# Altium schematic sheet usb_host_otg.SchDoc
size A3; SheetNumber: 17; SheetTotal: 21
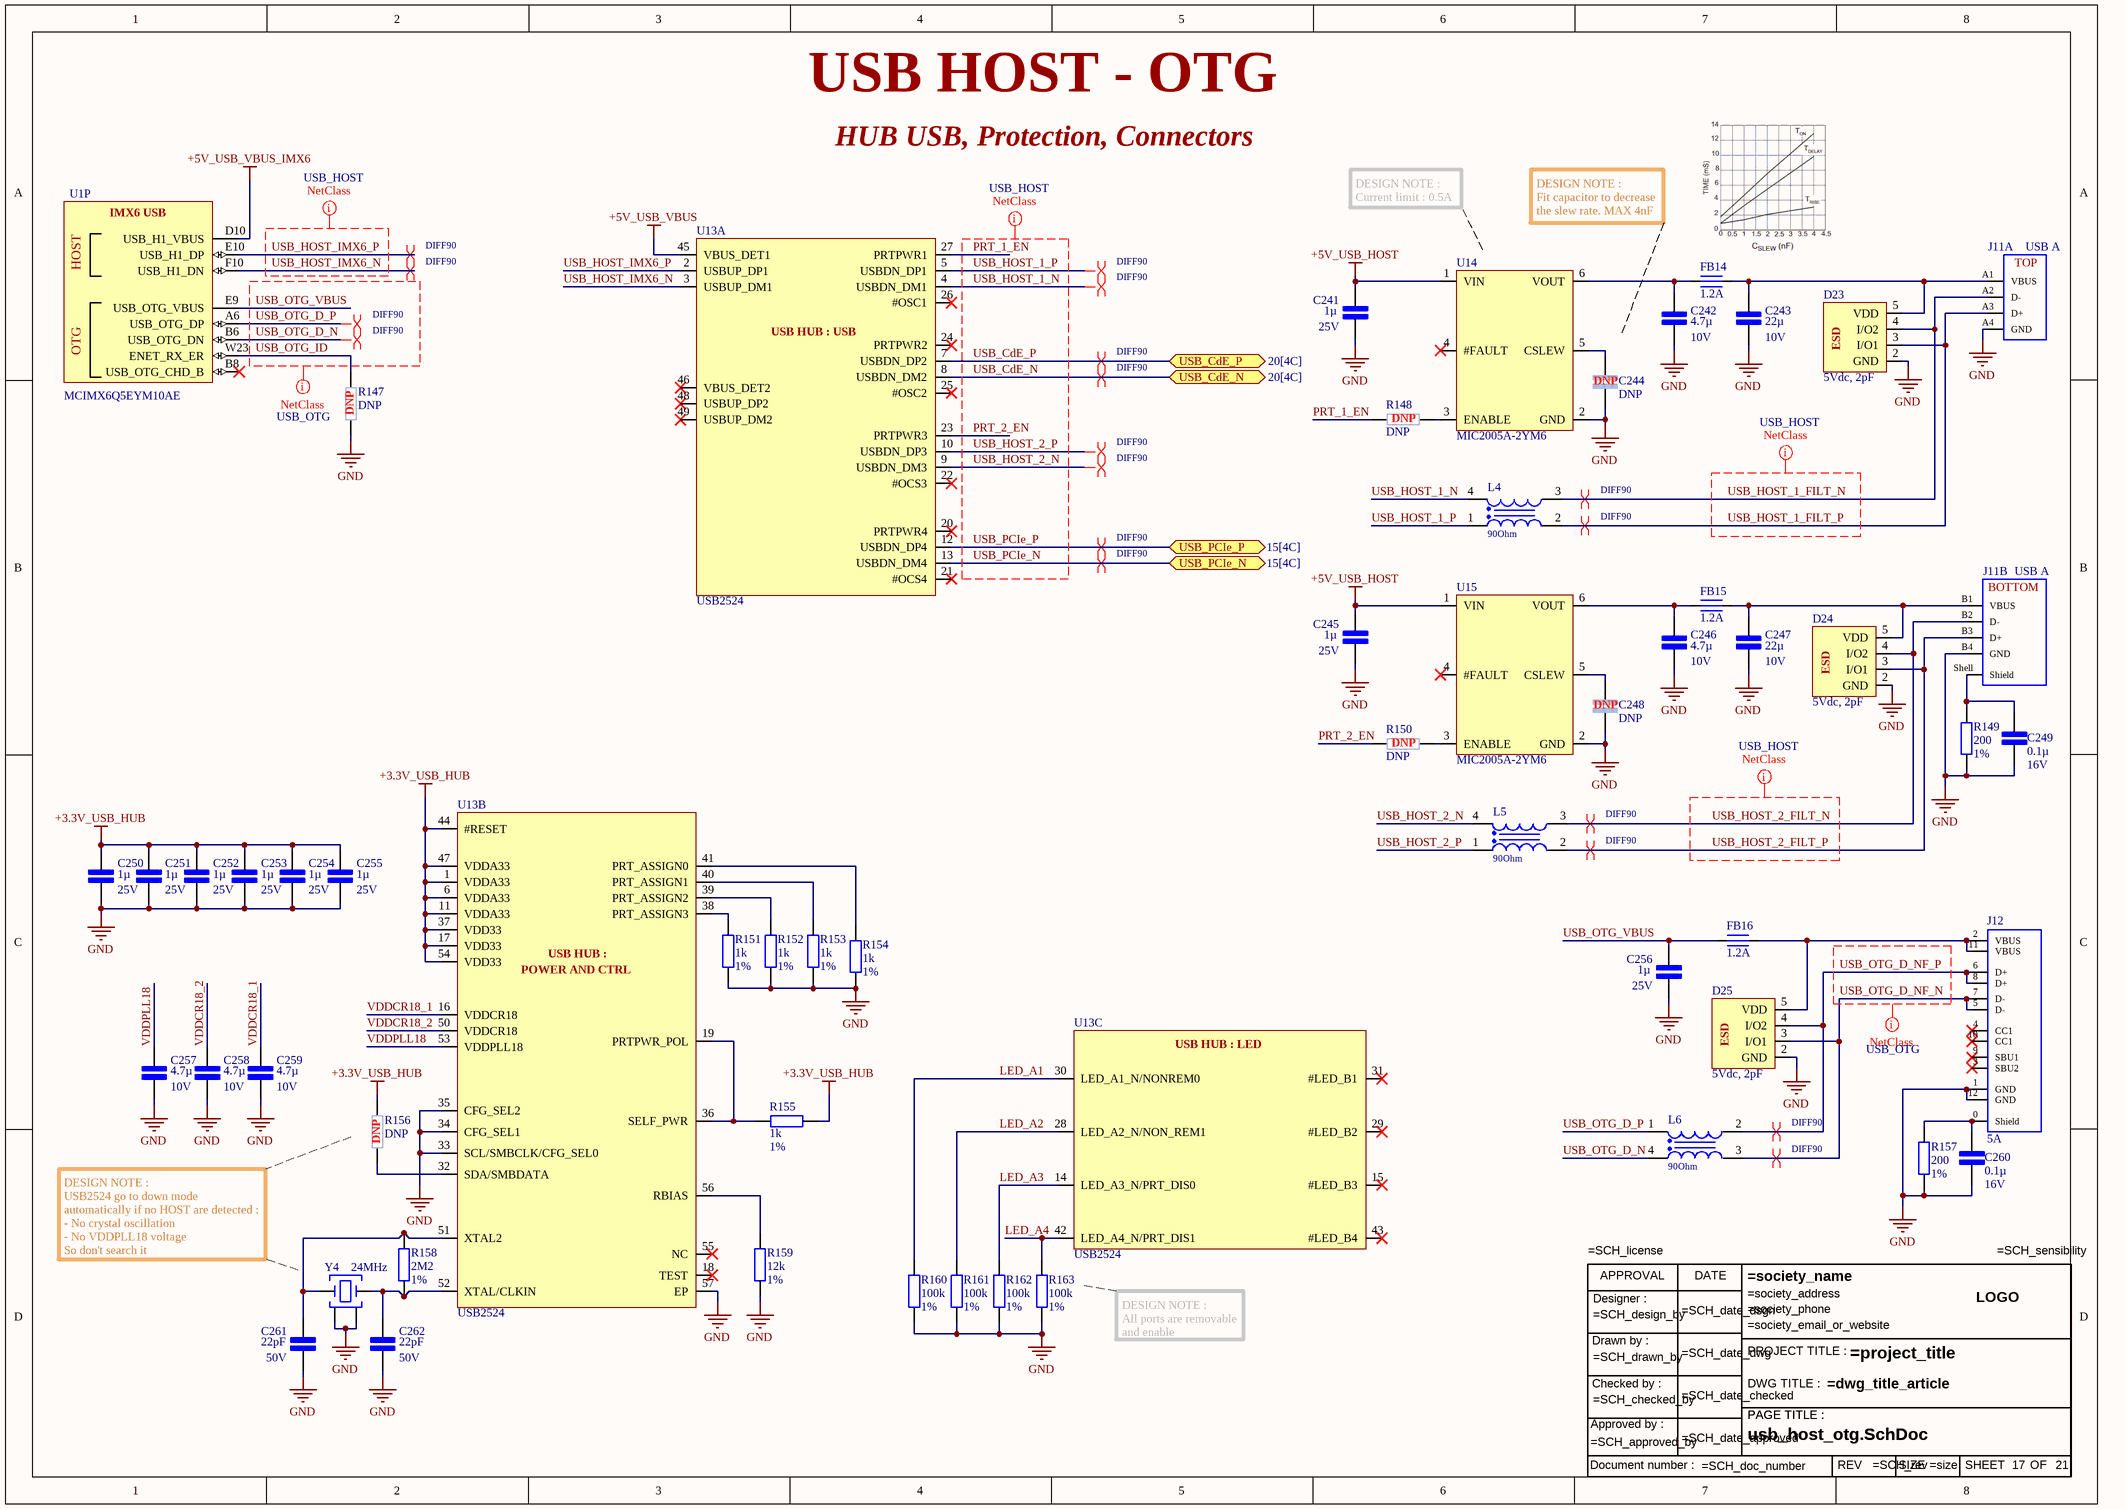
[diagram p0: usb_host_otg.SchDoc]

## Parts
C241  1µ  Tension du diélectrique: 25V  [Cap cer 0402/1005]
C242  4.7µ  Tension du diélectrique: 10V  [Cap cer 0402/1005]
C243  22µ  Tension du diélectrique: 10V  [Cap cer 0603/4608]
C244  DNP  [Cap cer 0402/1005]
C245  1µ  Tension du diélectrique: 25V  [Cap cer 0402/1005]
C246  4.7µ  Tension du diélectrique: 10V  [Cap cer 0402/1005]
C247  22µ  Tension du diélectrique: 10V  [Cap cer 0603/4608]
C248  DNP  [Cap cer 0402/1005]
C249  0.1µ  Tension du diélectrique: 16V  [Cap cer 0402/1005]
C250  1µ  Tension du diélectrique: 25V  [Cap cer 0402/1005]
C251  1µ  Tension du diélectrique: 25V  [Cap cer 0402/1005]
C252  1µ  Tension du diélectrique: 25V  [Cap cer 0402/1005]
C253  1µ  Tension du diélectrique: 25V  [Cap cer 0402/1005]
C254  1µ  Tension du diélectrique: 25V  [Cap cer 0402/1005]
C255  1µ  Tension du diélectrique: 25V  [Cap cer 0402/1005]
C256  1µ  Tension du diélectrique: 25V  [Cap cer 0402/1005]
C257  4.7µ  Tension du diélectrique: 10V  [Cap cer 0402/1005]
C258  4.7µ  Tension du diélectrique: 10V  [Cap cer 0402/1005]
C259  4.7µ  Tension du diélectrique: 10V  [Cap cer 0402/1005]
C260  0.1µ  Tension du diélectrique: 16V  [Cap cer 0402/1005]
C261  22pF  Tension du diélectrique: 50V  [Cap cer 0402/1005]
C262  22pF  Tension du diélectrique: 50V  [Cap cer 0402/1005]
D23  5Vdc, 2pF  [Sot-23-5]
D24  5Vdc, 2pF  [Sot-23-5]
D25  5Vdc, 2pF  [Sot-23-5]
FB14  1.2A  [inductor 0402/1005]
FB15  1.2A  [inductor 0402/1005]
FB16  1.2A  [inductor 0402/1005]
J11  USB A  [USBA_stacked_61400826021]  (parts A,B of 2)
J12  5A  [USB C 12 PIN 629722000214]
L4  90Ohm  [inductor coupled usb 0603]
L5  90Ohm  [inductor coupled usb 0603]
L6  90Ohm  [inductor coupled usb 0603]
R147  DNP  [Res 0402/1005]
R148  DNP  [Res 0402/1005]
R149  200  pourcentage: 1%  [Res 0402/1005]
R150  DNP  [Res 0402/1005]
R151  1k  pourcentage: 1%  [Res 0402/1005]
R152  1k  pourcentage: 1%  [Res 0402/1005]
R153  1k  pourcentage: 1%  [Res 0402/1005]
R154  1k  pourcentage: 1%  [Res 0402/1005]
R155  1k  pourcentage: 1%  [Res 0402/1005]
R156  DNP  [Res 0402/1005]
R157  200  pourcentage: 1%  [Res 0402/1005]
R158  2M2  pourcentage: 1%  [Res 0402/1005]
R159  12k  pourcentage: 1%  [Res 0402/1005]
R160  100k  pourcentage: 1%  [Res 0402/1005]
R161  100k  pourcentage: 1%  [Res 0402/1005]
R162  100k  pourcentage: 1%  [Res 0402/1005]
R163  100k  pourcentage: 1%  [Res 0402/1005]
TB16  Title bloc ANSI modified  (value not drawn)
U1  MCIMX6Q5EYM10AE  [FRES-2197-01]  (part P of 21)
U13  USB2524  [QFN56]  (parts A,B,C of 3)
U14  MIC2005A-2YM6  [SOt-23-6]
U15  MIC2005A-2YM6  [SOt-23-6]
Y4  24MHz  [IQXC-42]

## Ports
USB_CdE_N (bidir, see 20[4C]), USB_CdE_P (bidir, see 20[4C]), USB_PCIe_N (bidir, see 15[4C]), USB_PCIe_P (bidir, see 15[4C])

## Nets
+3.3V_USB_HUB: C250.1 C251.1 C252.1 C253.1 C254.1 C255.1 R155.2 R156.2 U13.1(VDDA33) U13.6(VDDA33) U13.11(VDDA33) U13.17(VDD33) U13.37(VDD33) U13.44(#RESET) U13.47(VDDA33) U13.54(VDD33)
+5V_USB_HOST: C241.1 C245.1 U14.1(VIN) U15.1(VIN)
+5V_USB_VBUS: U13.45(VBUS_DET1)
+5V_USB_VBUS_IMX6: U1.D10(USB_H1_VBUS)
GND: C241.2 C242.2 C243.2 C244.2 C245.2 C246.2 C247.2 C248.2 C249.2 C250.2 C251.2 C252.2 C253.2 C254.2 C255.2 C256.2 C257.2 C258.2 C259.2 C260.2 C261.2 C262.2 D23.2(GND) D24.2(GND) D25.2(GND) J11.A4(GND) J11.B4(GND) J12.1(GND) J12.12(GND) R147.1 R149.1 R151.1 R152.1 R153.1 R154.1 R157.1 R159.1 R160.1 R161.1 R162.1 R163.1 U13.33(SCL/SMBCLK/CFG_SEL0) U13.34(CFG_SEL1) U13.35(CFG_SEL2) U13.57(EP) U14.2(GND) U15.2(GND) Y4.2(GND) Y4.4(GND)
LED_A1: R160.2 U13.30(LED_A1_N/NONREM0)
LED_A2: R161.2 U13.28(LED_A2_N/NON_REM1)
LED_A3: R162.2 U13.14(LED_A3_N/PRT_DIS0)
LED_A4: R163.2 U13.42(LED_A4_N/PRT_DIS1)
PRT_1_EN: R148.1 U13.27(PRTPWR1)
PRT_2_EN: R150.1 U13.23(PRTPWR3)
USB_CdE_N: U13.8(USBDN_DM2) ; port USB_CdE_N
USB_CdE_P: U13.7(USBDN_DP2) ; port USB_CdE_P
USB_HOST_1_FILT_N: D23.4(I/O2) J11.A2(D-) L4.3
USB_HOST_1_FILT_P: D23.3(I/O1) J11.A3(D+) L4.2
USB_HOST_1_N: L4.4 U13.4(USBDN_DM1)
USB_HOST_1_P: L4.1 U13.5(USBDN_DP1)
USB_HOST_2_FILT_N: D24.4(I/O2) J11.B2(D-) L5.3
USB_HOST_2_FILT_P: D24.3(I/O1) J11.B3(D+) L5.2
USB_HOST_2_N: L5.4 U13.9(USBDN_DM3)
USB_HOST_2_P: L5.1 U13.10(USBDN_DP3)
USB_HOST_IMX6_N: U1.F10(USB_H1_DN) U13.3(USBUP_DM1)
USB_HOST_IMX6_P: U1.E10(USB_H1_DP) U13.2(USBUP_DP1)
USB_OTG_D_N: L6.4 U1.B6(USB_OTG_DN)
USB_OTG_D_NF_N: D25.3(I/O1) J12.5(D-) J12.7(D-) L6.3
USB_OTG_D_NF_P: D25.4(I/O2) J12.6(D+) J12.8(D+) L6.2
USB_OTG_D_P: L6.1 U1.A6(USB_OTG_DP)
USB_OTG_ID: R147.2 U1.W23(ENET_RX_ER)
USB_OTG_VBUS: C256.1 FB16.1 U1.E9(USB_OTG_VBUS)
USB_PCIe_N: U13.13(USBDN_DM4) ; port USB_PCIe_N
USB_PCIe_P: U13.12(USBDN_DP4) ; port USB_PCIe_P
VDDCR18_1: C259.1 U13.16(VDDCR18)
VDDCR18_2: C258.1 U13.50(VDDCR18)
VDDPLL18: C257.1 U13.53(VDDPLL18)
NetC242_1: C242.1 FB14.1 U14.6(VOUT)
NetC243_1: C243.1 D23.5(VDD) FB14.2 J11.A1(VBUS)
NetC244_1: C244.1 U14.5(CSLEW)
NetC246_1: C246.1 FB15.1 U15.6(VOUT)
NetC247_1: C247.1 D24.5(VDD) FB15.2 J11.B1(VBUS)
NetC248_1: C248.1 U15.5(CSLEW)
NetC249_1: C249.1 J11.Shell(Shield) R149.2
NetC260_1: C260.1 J12.0(Shield) R157.2
NetC261_1: C261.1 R158.2 U13.51(XTAL2) Y4.3(Crystal)
NetC262_1: C262.1 R158.1 U13.52(XTAL/CLKIN) Y4.1(Crystal)
NetD25_5: D25.5(VDD) FB16.2 J12.2(VBUS) J12.11(VBUS)
NetR148_2: R148.2 U14.3(ENABLE)
NetR150_2: R150.2 U15.3(ENABLE)
NetR151_2: R151.2 U13.38(PRT_ASSIGN3)
NetR152_2: R152.2 U13.39(PRT_ASSIGN2)
NetR153_2: R153.2 U13.40(PRT_ASSIGN1)
NetR154_2: R154.2 U13.41(PRT_ASSIGN0)
NetR155_1: R155.1 U13.19(PRTPWR_POL) U13.36(SELF_PWR)
NetR156_1: R156.1 U13.32(SDA/SMBDATA)
NetR159_2: R159.2 U13.56(RBIAS)

Not connected (* = marked no-connect by the designer): J12 3(SBU2)* 4(CC1)* 9(SBU1)* 10(CC1)*; U1 B8(USB_OTG_CHD_B)*; U13 15(#LED_B3)* 18(TEST)* 20(PRTPWR4)* 21(#OCS4)* 22(#OCS3)* 24(PRTPWR2)* 25(#OSC2)* 26(#OSC1)* 29(#LED_B2)* 31(#LED_B1)* 43(#LED_B4)* 46(VBUS_DET2)* 48(USBUP_DP2)* 49(USBUP_DM2)* 55(NC)*; U14 4(#FAULT)*; U15 4(#FAULT)*

## Layout directives
net class USB_OTG: USB_OTG_D_N, USB_OTG_D_NF_N, USB_OTG_D_NF_P, USB_OTG_D_P, USB_OTG_ID, USB_OTG_VBUS
net class USB_HOST: PRT_1_EN, PRT_2_EN, USB_CdE_N, USB_CdE_P, USB_HOST_1_FILT_N, USB_HOST_1_FILT_P, USB_HOST_1_N, USB_HOST_1_P, USB_HOST_2_FILT_N, USB_HOST_2_FILT_P, USB_HOST_2_N, USB_HOST_2_P, USB_HOST_IMX6_N, USB_HOST_IMX6_P, USB_PCIe_N, USB_PCIe_P
differential pair; differential pair class DIFF90: USB_CdE_N, USB_CdE_P, USB_HOST_1_FILT_N, USB_HOST_1_FILT_P, USB_HOST_1_N, USB_HOST_1_P, USB_HOST_2_FILT_N, USB_HOST_2_FILT_P, USB_HOST_2_N, USB_HOST_2_P, USB_HOST_IMX6_N, USB_HOST_IMX6_P, USB_OTG_D_N, USB_OTG_D_NF_N, USB_OTG_D_NF_P, USB_OTG_D_P, USB_PCIe_N, USB_PCIe_P

## Notes on the sheet
- USB HOST - OTG
- HUB USB, Protection, Connectors
- DESIGN NOTE :
  Current limit : 0.5A
- DESIGN NOTE :
  Fit capacitor to decrease the slew rate. MAX 4nF
- DESIGN NOTE :
  USB2524 go to down mode automatically if no HOST are detected :
  - No crystal oscillation
  - No VDDPLL18 voltage
  So don't search it
- DESIGN NOTE :
  All ports are removable and enable
- (in symbol IC USB2524, part A) USB HUB : USB
- (in symbol IC USB2524, part B) USB HUB :; POWER AND CTRL
- (in symbol IC USB2524, part C) USB HUB : LED
- (in symbol IMX6Q5EYM10AE, part P) IMX6 USB; HOST; OTG
- (in symbol Title bloc ANSI) APPROVAL; DATE; Designer :; LOGO; Drawn by :; PROJECT TITLE :; Checked by :; DWG TITLE :; PAGE TITLE :; Approved by :; Document number :; REV; SIZE; SHEET; OF
- (in symbol TVS USB 824011) ESD
- (in symbol USBA_stacked_61400826021, part A) TOP
- (in symbol USBA_stacked_61400826021, part B) BOTTOM

## Library data of the parts
C241 C245 C250-C256 = cap 1µ 25V: cap cer 1µ 25V 10% X5R 0402; Diélectrique: X5R
C242 C246 C257-C259 = cap 4.7µ 10V: cap cer 4.7µ 10V 10% X7R 0402; Diélectrique: X7R
C243 C247 = cap 22µ 10V: cap cer 22µ 10V 10% X5R 0603; Diélectrique: X5R
C244 C248 = cap DNP: cap cer DNP 0402
C249 C260 = cap 0.1µ 16V: cap solid electrolyte 0.1µ 6.3V 10%; Diélectrique: X7R
C261 C262 = cap 22pF 50V: cap cer 22pF 50V 5% NP0 0402; Diélectrique: NP0
D23-D25 = TVS USB 824011: WE-TVS TVS Diode – High Speed Series, SOT23-5L, 2+1 Channel, 5Vdc, 2pF; Manufacturer Part Number: 824011; Manufacturer: Wurth Elektronik; Reverse Peak Pulse Current: 13A; Channel ESD Clamping Voltage: 13V; Channel Operating Voltage: 5V; Channel Reverse Leakage Current: 1uA; ESD Air Discharge Capability: 24kV; ESD Contact Discharge Capability: 16kV; Polarity: Unidirectional; Reverse Breakdown Voltage: 6.1V; ComponentLink1Description: Manufacturer Link; ComponentLink1URL: http://www.we-online.de; ComponentLink2Description: Datasheet; ComponentLink2URL: https://www.we-online.com/catalog/datasheet/824011.pdf; Size: SOT23-5L; Mounting Technology: SMT; Packaging: Tape and Reel; Channel Input Capacitance: 2pF; Channel Number: 2+1; Height: 1.16mm; Length: 2.9mm; Operating Temperature max.: 125C; Operating Temperature min.: -55C; Width: 2.8mm
FB14-FB16 = Ferrite bead 0402: ferrite bead 1.2A 70mohm / 74269242111; ComponentLink1Description: New link; ComponentLink1URL: https://www.we-online.com/catalog/datasheet/74269242111.pdf
J11 = USBA_stacked_61400826021: 2x USB type A, stacked
J12 = USB C 12 pin 629722000214: 629722000214 wurth connector, up to 5A
L4-L6 = inductor coupled USB: WE-CNSW SMT Common Mode Line Filter, size 0603, 90Ohm, 0.55A, 50V; Manufacturer Part Number: 744230900; Manufacturer: Wurth Elektronik; DC Resistance max.: 0.145Ohm; Impedance Test Condition: 100MHz; Insulation Test Voltage: 125VAC; Winding Style: bifiliar; ComponentLink1Description: Manufacturer; ComponentLink1URL: http://www.we-online.de; ComponentLink2Description: Datasheet; ComponentLink2URL: https://www.we-online.com/catalog/datasheet/744230900.pdf; Operating Temperature: -40 to +125degC; Packaging: Tape and Reel; Published Date: April 2020; Rated Current: 0.55A; Size: 0603; Impedance: 90Ohm; Rated Voltage: 50V; Mounting Technology: SMT
R147 R148 R150 R156 = res DNP 0402: res DNP 0403; pourcentage: 1%
R149 R157 = res 200 1%: res 200 1% 0402
R151-R155 = res 1k 1%: res 1k 1% 0402
R158 = res 2M2 1%: res 2M2 1% 0402
R159 = res 12k 1%: res 12k 1% 0402
R160-R163 = res 100k 1%: res 100k 1% 0402
TB16 = Title bloc ANSI
U1 = IMX6Q5EYM10AE: 32-Bit i.MX 6 Quad Application Processor, 1 GHz, 256 KB RAM, Extended Consumer Grade, 624-Pin FCPBGA, RoHS, Tape and Reel; PartNumber: MCIMX6Q5EYM10ACR; Manufacturer: Freescale Semiconductor; CAN: FlexCAN; Number of Cores: 4 Spec; External Memory Supported: DDR3, DDR3L, FLASH, LPDDR2; Speed Grade: 1 GHz; Core Type: ARM Cortex A9; Cache (KB): 32; Ethernet: 1 Gbps + IEEE 1588; Internal RAM (KB): 256; ComponentLink1Description: Manufacturer URL; ComponentLink2Description: Datasheet; DatasheetVersion: Rev. 2.3; ComponentLink3URL: http://cache.freescale.com/files/32bit/doc/data_sheet/IMX6DQCEC.pdf?fpsp=1&WT_TYPE=Data%20Sheets&WT_VENDOR=FREESCALE&WT_FILE_FORMAT=pdf&WT_ASSET=Documentation; ComponentLink1URL: http://www.freescale.com/; Packing: Tape and Reel; Temperature Range: -20 to 105 degC; ComponentLink2URL: http://cache.freescale.com/files/32bit/doc/data_sheet/IMX6DQCEC.pdf?fpsp=1&WT_TYPE=Data%20Sheets&WT_VENDOR=FREESCALE&WT_FILE_FORMAT=pdf&WT_ASSET=Documentation; ComponentLink3Description: Package Specification; PackageVersion: Rev. A; RoHS: TRUE; Quad/Dual CPU: i.MX 6Quad; Mounting Technology: Surface Mount; PackageReference: FCPBGA-624; PackageDescription: 624-pin Ball Grid Array Package, Body 21 x 21mm, Pitch 0.8mm
U13 = IC USB2524: USB hub 4 ports
U14 U15 = IC MIC2005A: Current limiter 0.5A; ComponentLink1Description: New link; ComponentLink1URL: https://ww1.microchip.com/downloads/aemDocuments/documents/APID/ProductDocuments/DataSheets/MIC20XX-Fixed-and-Adjustable-Current-Limiting-Power-Distribution-Switches-DS20006486B.pdf
Y4 = XTAL 24MHz: WE-XTAL 24MHz, +/-10ppm / 830108212309; Manufacturer: Wurth Elektronik; Load Capacitance: 10pF; ComponentLink2Description: Datasheet; ComponentLink2URL: https://www.we-online.com/catalog/datasheet/830108212309.pdf; Operating Temperature: -20 to +70degC; Packaging: Tape and Reel; Manufacturer Part Number: 830108212309; Published Date: July 2020; Frequency Stability: +/-10ppm; Frequency: 24MHz; Frequency Tolerance: +/-10ppm; Mounting Technology: SMT